# EAGLE design glove (EAGLE 7.7.0)

## Sheet 1 of 5
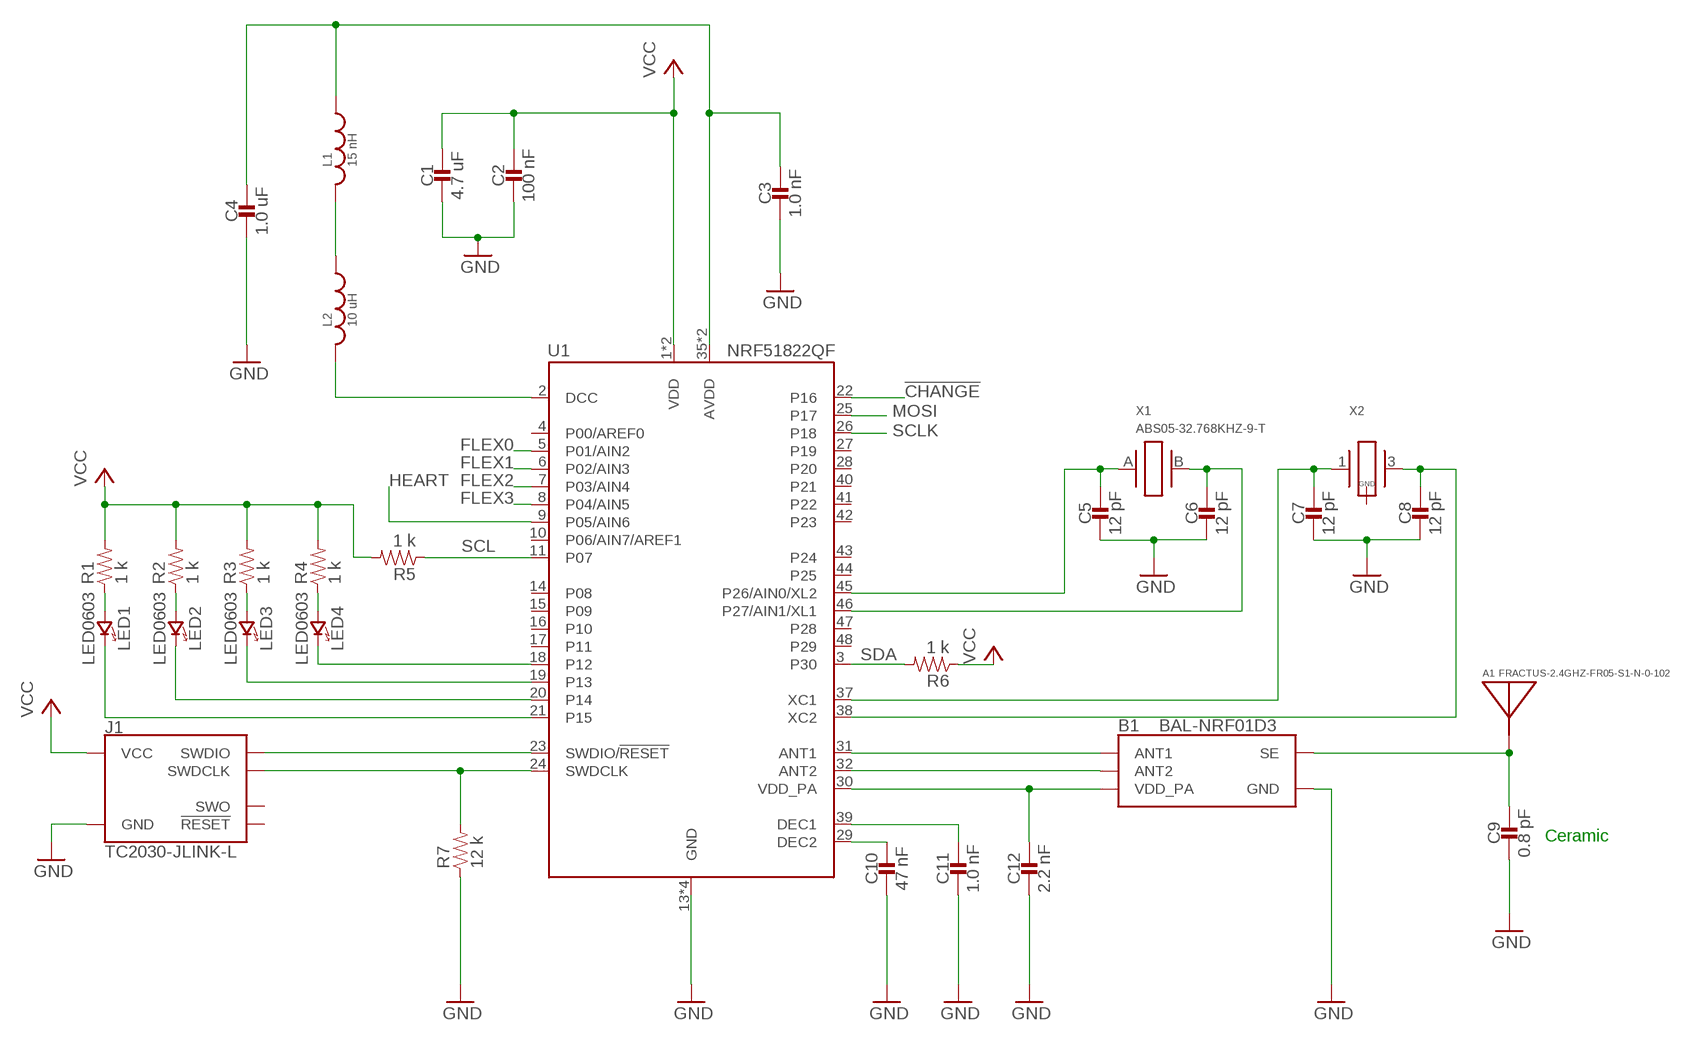
[diagram p0: schematic, sheet 1]

### Parts
A1  FRACTUS-2.4GHZ-FR05-S1-N-0-102  [FRACTUS-ANTENNA-FR05-S1-N-0-102]
B1  BAL-NRF01D3  [BAL-NRF01D3]
C1  4.7 uF  CAPACITOR0603_CAP  [0603_CAP]
C2  100 nF  CAPACITOR0402_CAP  [0402_CAP]
C3  1.0 nF  CAPACITOR0402_CAP  [0402_CAP]
C4  1.0 uF  CAPACITOR0603_CAP  [0603_CAP]
C5  12 pF  CAPACITOR0402_CAP  [0402_CAP]
C6  12 pF  CAPACITOR0402_CAP  [0402_CAP]
C7  12 pF  CAPACITOR0402_CAP  [0402_CAP]
C8  12 pF  CAPACITOR0402_CAP  [0402_CAP]
C9  0.8 pF  CAPACITOR0402_CAP  [0402_CAP]
C10  47 nF  CAPACITOR0402_CAP  [0402_CAP]
C11  1.0 nF  CAPACITOR0402_CAP  [0402_CAP]
C12  2.2 nF  CAPACITOR0402_CAP  [0402_CAP]
J1  TC2030-JLINK-L  [TC2030-IDC]
L1  15 nH  INDUCTOR0402  [0402_CAP]
L2  10 uH  INDUCTOR0603  [0603_CAP]
LED1  LED0603  [LED-0603]
LED2  LED0603  [LED-0603]
LED3  LED0603  [LED-0603]
LED4  LED0603  [LED-0603]
R1  1 k  RESISTOR0603_RES  [0603-RES]
R2  1 k  RESISTOR0603_RES  [0603-RES]
R3  1 k  RESISTOR0603_RES  [0603-RES]
R4  1 k  RESISTOR0603_RES  [0603-RES]
R5  1 k  RESISTOR0603_RES  [0603-RES]
R6  1 k  RESISTOR0603_RES  [0603-RES]
R7  12 k  RESISTOR0603_RES  [0603-RES]
U1  NRF51822QF  [QFN-48-6MM]
X1  ABS05-32.768KHZ-9-T  [ABS05]
X2  TXC-8Y  [TXC-8Y]

### Nets
!CHANGE: U1.22(P16) ; also sheet 3
FLEX0: U1.5(P01/AIN2) ; also sheet 5
FLEX1: U1.6(P02/AIN3) ; also sheet 5
FLEX2: U1.7(P03/AIN4) ; also sheet 5
FLEX3: U1.8(P04/AIN5) ; also sheet 5
GND: B1.GND C1.2 C2.2 C3.2 C4.2 C5.2 C6.2 C7.2 C8.2 C9.2 C10.2 C11.2 C12.2 J1.5(GND) R7.1 U1.13(GND) U1.33(GND) U1.34(GND) U1.GND ; also sheet 2,3,4,5
HEART: U1.9(P05/AIN6) ; also sheet 5
MOSI: U1.25(P17) ; also sheet 5
N$6: LED2.C(CATHODE) U1.20(P14)
N$8: LED2.A(ANODE) R2.1
N$10: LED1.C(CATHODE) U1.21(P15)
N$11: LED1.A(ANODE) R1.1
N$12: LED4.C(CATHODE) U1.18(P12)
N$13: LED4.A(ANODE) R4.1
N$14: L2.2 U1.2(DCC)
N$15: L1.2 L2.1
N$16: C3.1 C4.1 L1.1 U1.35(AVDD) U1.36(AVDD)
N$19: J1.2(SWDIO) U1.23(SWDIO/!RESET)
N$20: C8.1 U1.38(XC2) X2.3
N$21: B1.ANT1 U1.31(ANT1)
N$22: B1.ANT2 U1.32(ANT2)
N$23: B1.VCC(VDD_PA) C12.1 U1.30(VDD_PA)
N$24: A1.1(ANTENNA) B1.SE C9.1
N$25: C10.1 U1.29(DEC2)
N$26: C11.1 U1.39(DEC1)
N$27: C5.1 U1.45(P26/AIN0/XL2) X1.A
N$28: C6.1 U1.46(P27/AIN1/XL1) X1.B
N$29: C7.1 U1.37(XC1) X2.1
N$30: J1.4(SWDCLK) R7.2 U1.24(SWDCLK)
N$42: LED3.A(ANODE) R3.1
N$43: LED3.C(CATHODE) U1.19(P13)
SCL: R5.1 U1.11(P07) ; also sheet 2,3
SCLK: U1.26(P18) ; also sheet 5
SDA: R6.2 U1.3(P30) ; also sheet 2,3
VCC: C1.1 C2.1 J1.1(VCC) R1.2 R2.2 R3.2 R4.2 R5.2 R6.1 U1.1(VDD) U1.12(VDD) ; also sheet 2,3,4,5
Unconnected: J1.3(!RESET) J1.6(SWO) U1.4(P00/AREF0) U1.10(P06/AIN7/AREF1) U1.14(P08) U1.15(P09) U1.16(P10) U1.17(P11) U1.27(P19) U1.28(P20) U1.40(P21) U1.41(P22) U1.42(P23) U1.43(P24) U1.44(P25) U1.47(P28) U1.48(P29) X2.2(GND) X2.4(GND)

### Notes on the sheet
- Ceramic

## Sheet 2 of 5
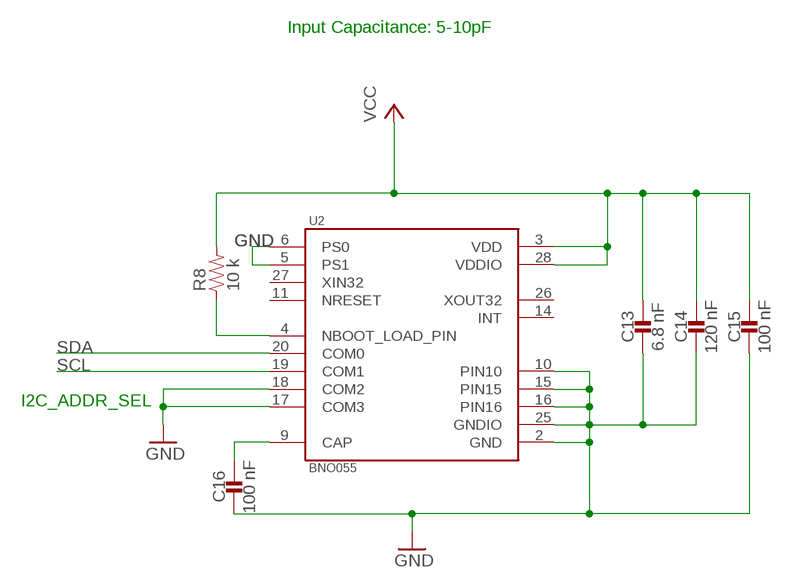
[diagram p1: schematic, sheet 2]

### Parts
C13  6.8 nF  CAPACITOR0603_CAP  [0603_CAP]
C14  120 nF  CAPACITOR0603_CAP  [0603_CAP]
C15  100 nF  CAPACITOR0603_CAP  [0603_CAP]
C16  100 nF  CAPACITOR0603_CAP  [0603_CAP]
R8  10 k  RESISTOR0603_RES  [0603-RES]
U2  BNO055  [LGA28R50P4X10_380X520X100]

### Nets
GND: C13.2 C14.2 C15.2 C16.2 U2.2(GND) U2.5(PS1) U2.6(PS0) U2.10(PIN10) U2.15(PIN15) U2.16(PIN16) U2.17(COM3) U2.18(COM2) U2.25(GNDIO) ; also sheet 1,3,4,5
N$9: C16.1 U2.9(CAP)
N$18: R8.1 U2.4(NBOOT_LOAD_PIN)
SCL: U2.19(COM1) ; also sheet 1,3
SDA: U2.20(COM0) ; also sheet 1,3
VCC: C13.1 C14.1 C15.1 R8.2 U2.3(VDD) U2.28(VDDIO) ; also sheet 1,3,4,5
Unconnected: U2.11(NRESET) U2.14(INT) U2.26(XOUT32) U2.27(XIN32)

### Notes on the sheet
- Input Capacitance: 5-10pF
- I2C_ADDR_SEL

## Sheet 3 of 5
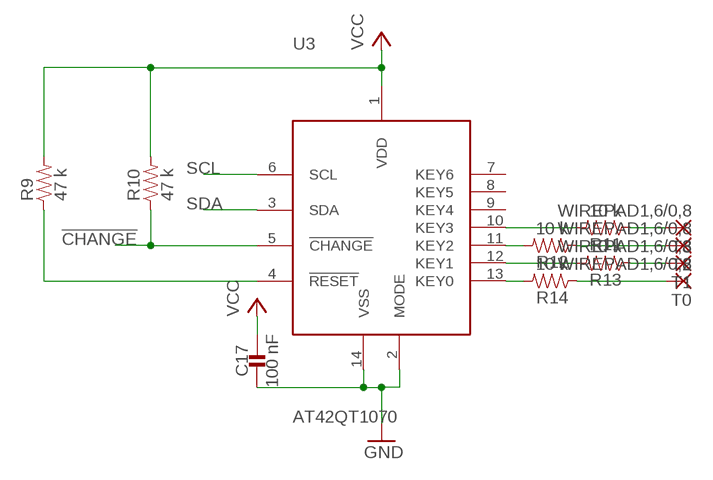
[diagram p2: schematic, sheet 3]

### Parts
C17  100 nF  CAPACITOR0603_CAP  [0603_CAP]
R9  47 k  RESISTOR0603_RES  [0603-RES]
R10  47 k  RESISTOR0603_RES  [0603-RES]
R11  10 k  RESISTOR0603_RES  [0603-RES]
R12  10 k  RESISTOR0603_RES  [0603-RES]
R13  10 k  RESISTOR0603_RES  [0603-RES]
R14  10 k  RESISTOR0603_RES  [0603-RES]
T0  WIREPAD1,6/0,8  [1,6/0,8]
T1  WIREPAD1,6/0,8  [1,6/0,8]
T2  WIREPAD1,6/0,8  [1,6/0,8]
T3  WIREPAD1,6/0,8  [1,6/0,8]
U3  AT42QT1070  [QT1070]

### Nets
!CHANGE: R10.1 U3.5(!CHANGE) ; also sheet 1
GND: C17.2 U3.2(MODE) U3.14(VSS) ; also sheet 1,2,4,5
N$31: R11.2 U3.10(KEY3)
N$32: R11.1 T3.1(P)
N$33: R12.2 U3.11(KEY2)
N$34: R12.1 T2.1(P)
N$35: R13.2 U3.12(KEY1)
N$36: R13.1 T1.1(P)
N$37: R14.2 U3.13(KEY0)
N$39: R14.1 T0.1(P)
N$40: R9.1 U3.4(!RESET)
SCL: U3.6(SCL) ; also sheet 1,2
SDA: U3.3(SDA) ; also sheet 1,2
VCC: C17.1 R9.2 R10.2 U3.1(VDD) ; also sheet 1,2,4,5
Unconnected: U3.7(KEY6) U3.8(KEY5) U3.9(KEY4)

## Sheet 4 of 5
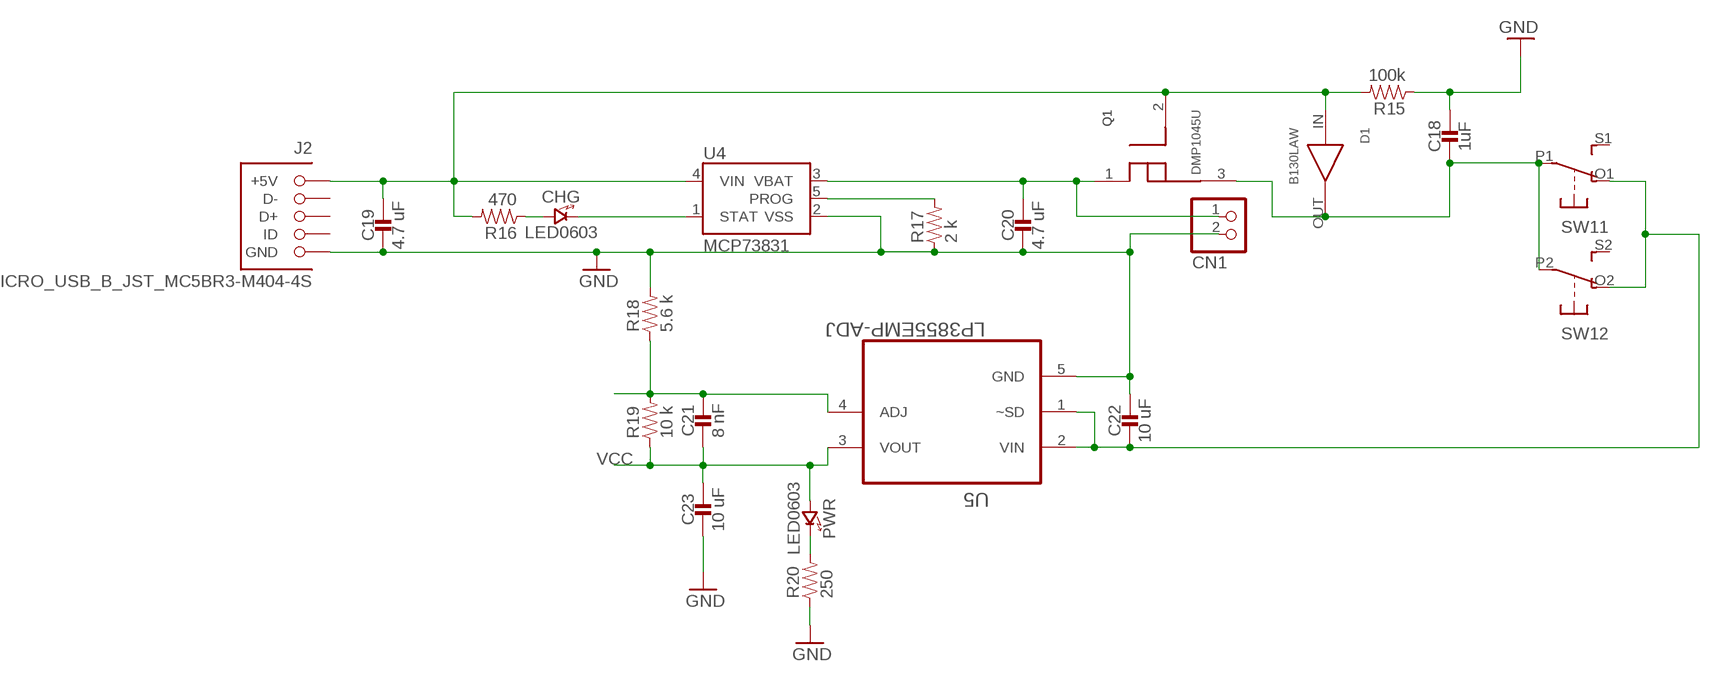
[diagram p3: schematic, sheet 4]

### Parts
C18  1uF  CAPACITOR0603_CAP  [0603_CAP]
C19  4.7 uF  CAPACITOR0603_CAP  [0603_CAP]
C20  4.7 uF  CAPACITOR0603_CAP  [0603_CAP]
C21  8 nF  CAPACITOR0603_CAP  [0603_CAP]
C22  10 uF  CAPACITOR0603_CAP  [0603_CAP]
C23  10 uF  CAPACITOR0603_CAP  [0603_CAP]
CHG  LED0603  [LED-0603]
CN1  JST_2PIN-SMT-RA  [JST-PH-2-SMT-RA]
D1  B130LAW  [2PIN]
J2  MICRO_USB_B_JST_MC5BR3-M404-4S  [USB_MICRO_B-JST-MC5BR3-M404-4S-TB]
PWR  LED0603  [LED-0603]
Q1  DMP1045U  [3PIN]
R15  100k  RESISTOR0603_RES  [0603-RES]
R16  470  RESISTOR0603_RES  [0603-RES]
R17  2 k  RESISTOR0603_RES  [0603-RES]
R18  5.6 k  RESISTOR0603_RES  [0603-RES]
R19  10 k  RESISTOR0603_RES  [0603-RES]
R20  250  RESISTOR0603_RES  [0603-RES]
SW1  DPDT-EG1390  [EG1390]
U4  MCP73831  [SOT23-5]
U5  LP3855EMP-ADJ  [SOT150P696X180-5N]

### Nets
GND: C18.1 C19.2 C20.2 C22.1 C23.2 CN1.2 J2.5(GND) R15.1 R17.1 R18.2 R20.1 U4.2(VSS) U5.5(GND) ; also sheet 1,2,3,5
N$1: C18.2 D1.OUT Q1.3(SOURCE) SW1.P1(1:P) SW1.P2(2:P)
N$2: CHG.A(ANODE) R16.1
N$3: CHG.C(CATHODE) U4.1(STAT)
N$4: R17.2 U4.5(PROG)
N$7: C21.1 R18.1 R19.2 U5.4(ADJ)
N$17: PWR.C(CATHODE) R20.2
N$38: C19.1 D1.IN J2.1(+5V) Q1.2(GATE) R15.2 R16.2 U4.4(VIN)
N$41: C20.1 CN1.1 Q1.1(DRAIN) U4.3(VBAT)
N$54: C22.2 SW1.O1(1:O) SW1.O2(2:O) U5.1(~SD) U5.2(VIN)
VCC: C21.2 C23.1 PWR.A(ANODE) R19.1 U5.3(VOUT) ; also sheet 1,2,3,5
Unconnected: J2.2(D-) J2.3(D+) J2.4(ID) SW1.S1(1:S) SW1.S2(2:S)

## Sheet 5 of 5
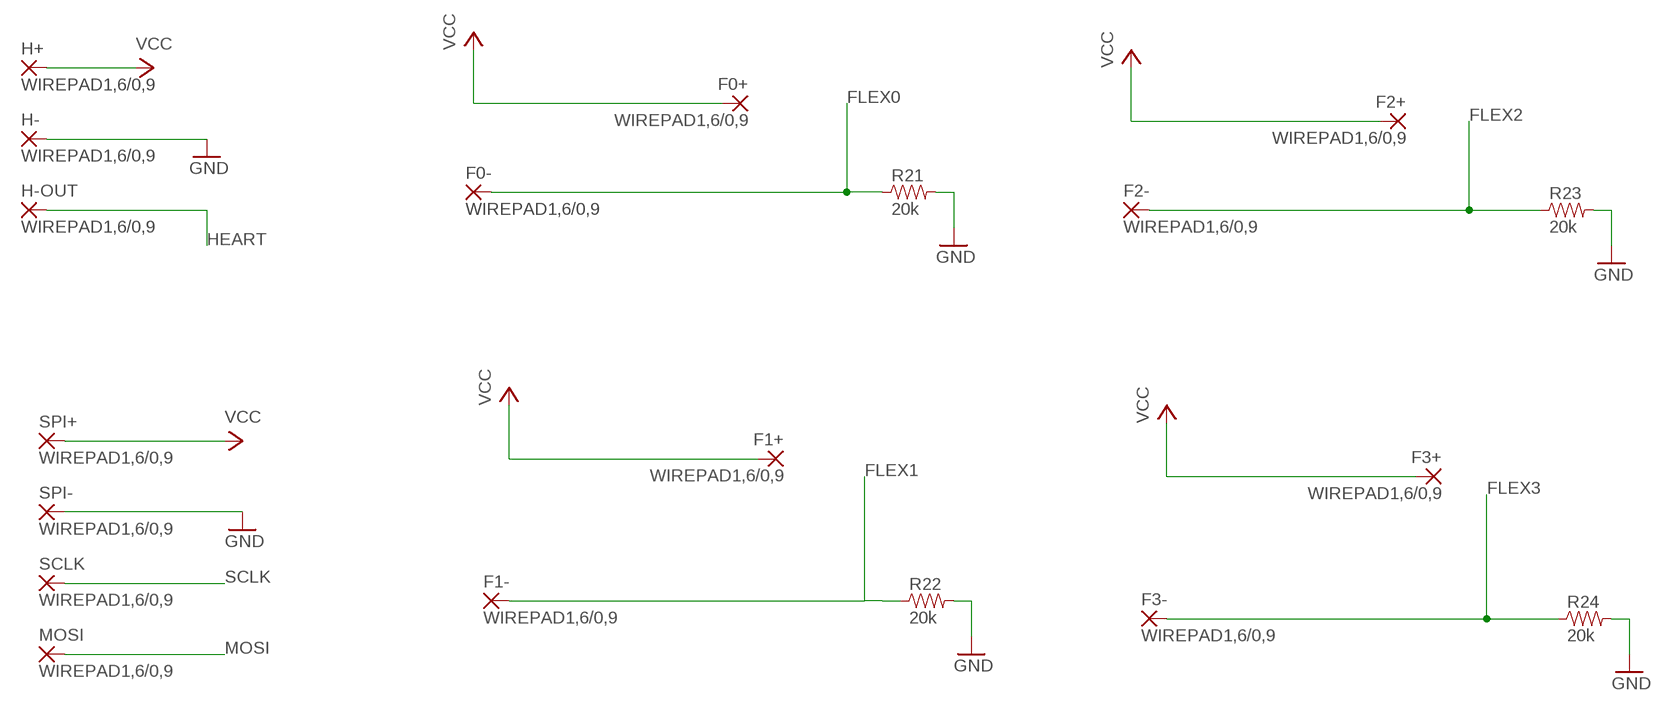
[diagram p4: schematic, sheet 5]

### Parts
F0+  WIREPAD1,6/0,9  [1,6/0,9]
F0-  WIREPAD1,6/0,9  [1,6/0,9]
F1+  WIREPAD1,6/0,9  [1,6/0,9]
F1-  WIREPAD1,6/0,9  [1,6/0,9]
F2+  WIREPAD1,6/0,9  [1,6/0,9]
F2-  WIREPAD1,6/0,9  [1,6/0,9]
F3+  WIREPAD1,6/0,9  [1,6/0,9]
F3-  WIREPAD1,6/0,9  [1,6/0,9]
H+  WIREPAD1,6/0,9  [1,6/0,9]
H-  WIREPAD1,6/0,9  [1,6/0,9]
H-OUT  WIREPAD1,6/0,9  [1,6/0,9]
MOSI  WIREPAD1,6/0,9  [1,6/0,9]
R21  20k  RESISTOR0603_RES  [0603-RES]
R22  20k  RESISTOR0603_RES  [0603-RES]
R23  20k  RESISTOR0603_RES  [0603-RES]
R24  20k  RESISTOR0603_RES  [0603-RES]
SCLK  WIREPAD1,6/0,9  [1,6/0,9]
SPI+  WIREPAD1,6/0,9  [1,6/0,9]
SPI-  WIREPAD1,6/0,9  [1,6/0,9]

### Nets
FLEX0: F0-.1(P) R21.1 ; also sheet 1
FLEX1: F1-.1(P) R22.1 ; also sheet 1
FLEX2: F2-.1(P) R23.1 ; also sheet 1
FLEX3: F3-.1(P) R24.1 ; also sheet 1
GND: H-.1(P) R21.2 R22.2 R23.2 R24.2 SPI-.1(P) ; also sheet 1,2,3,4
HEART: H-OUT.1(P) ; also sheet 1
MOSI: MOSI.1(P) ; also sheet 1
SCLK: SCLK.1(P) ; also sheet 1
VCC: F0+.1(P) F1+.1(P) F2+.1(P) F3+.1(P) H+.1(P) SPI+.1(P) ; also sheet 1,2,3,4

## Library data of the parts
A1 = chips:FRACTUS-2.4GHZ-FR05-S1-N-0-102: Fractus Compact Reach XtendTM chip antenna is engineered specifically for Bluetooth, WLAN 802.11 b/g/n and other wireless devices operating at the ISM 2.4 GHz band. Compact Reach Xtend combines small form factor size and high performance to improve the functionality of your wireless devices.; RICHARDSON_RFPD: FR05-S1-N-0102B
B1 = chips:BAL-NRF01D3: 50 ohm nominal input / conjugate match balun to nRF51422-QFAA, nRF24LE1, nRF51822-QFAA/AB, with integrated harmonic filter; DIGIKEY: 497-13637-1-ND; MOUSER: 511-BAL-NRF01D3
C1-C23 = passives:CAPACITOR: 0402 Capacitor
CHG LED1-LED4 PWR = leds:LED: LED
CN1 = adafruit:JST_2PIN: JST 2-Pin Connectors of various flavors SMT-RA (S2B-PH-SM4) 4UConnector #17311 SMT (B2B-PH-SM4) THM-RA (S2B-PH) THM (B2B-PH)
D1 = load_balance:B130LAW
F0+ F0- F1+ F1- F2+ F2- F3+ F3- H+ H- H-OUT MOSI SCLK SPI+ SPI- T0 T1-T3 = wirepad:WIREPAD: Wire PAD connect wire on PCB
J1 = connector:TC2030-JLINK
J2 = connector:MICRO_USB_B_JST_MC5BR3-M404-4S: Micro USB B mid mount; DIGIKEY: 455-2567-2-ND; MOUSER: 53X3655
L1 L2 = passives:INDUCTOR: A very specific inductor
Q1 = load_balance:DMP1045U
R1-R24 = passives:RESISTOR: Resistor Basic schematic elements and footprints for 0603, 1206, and PTH resistors.
SW1 = adafruit:DPDT
U1 = chips:NRF51822: Multiprotocol Bluetooth� 4.0 low energy/2.4 GHz RF SoC; DIGIKEY: 1490-1032-1-ND; MOUSER: 949-NRF51822-QFAB-R7
U2 = BNO055:BNO055: BNO055 9-axis Absolute Orientation Sensor ( SiP ) w/Sensors and Sensor Fusion; AVAILABILITY: Good; DESCRIPTION: BNO055 9-axis Absolute Orientation Sensor ( SiP ) w/Sensors and Sensor Fusion; MF: Bosch; MP: BNO055; PACKAGE: LGA-28 Bosch; PRICE: 9.48 USD
U3 = QT1070:AT42QT1070
U4 = SparkFun-PowerIC:MCP73831: Miniature single cell, fully integrated Li-Ion, Li-polymer charge management controller http://ww1.microchip.com/downloads/en/DeviceDoc/21984a.pdf
U5 = LP3855EMP-ADJ:LP3855EMP-ADJ: Linear Regulators; AVAILABILITY: Good; DESCRIPTION: 1.5A Fast Response Ultra Low Dropout Linear Regulators 5-SOT-223 -40 to 125; MF: Texas Instruments; MP: LP3855EMP-ADJ; PACKAGE: SOT-223 Texas Instruments; PRICE: 3.03 USD
X1 = crystals:ABS05-32.768KHZ: 32.768kHz Crystal; DIGIKEY: 535-11897-1-ND
X2 = crystals:TXC-8Y: 2mmx1.6mm SMD Crystal

## Board
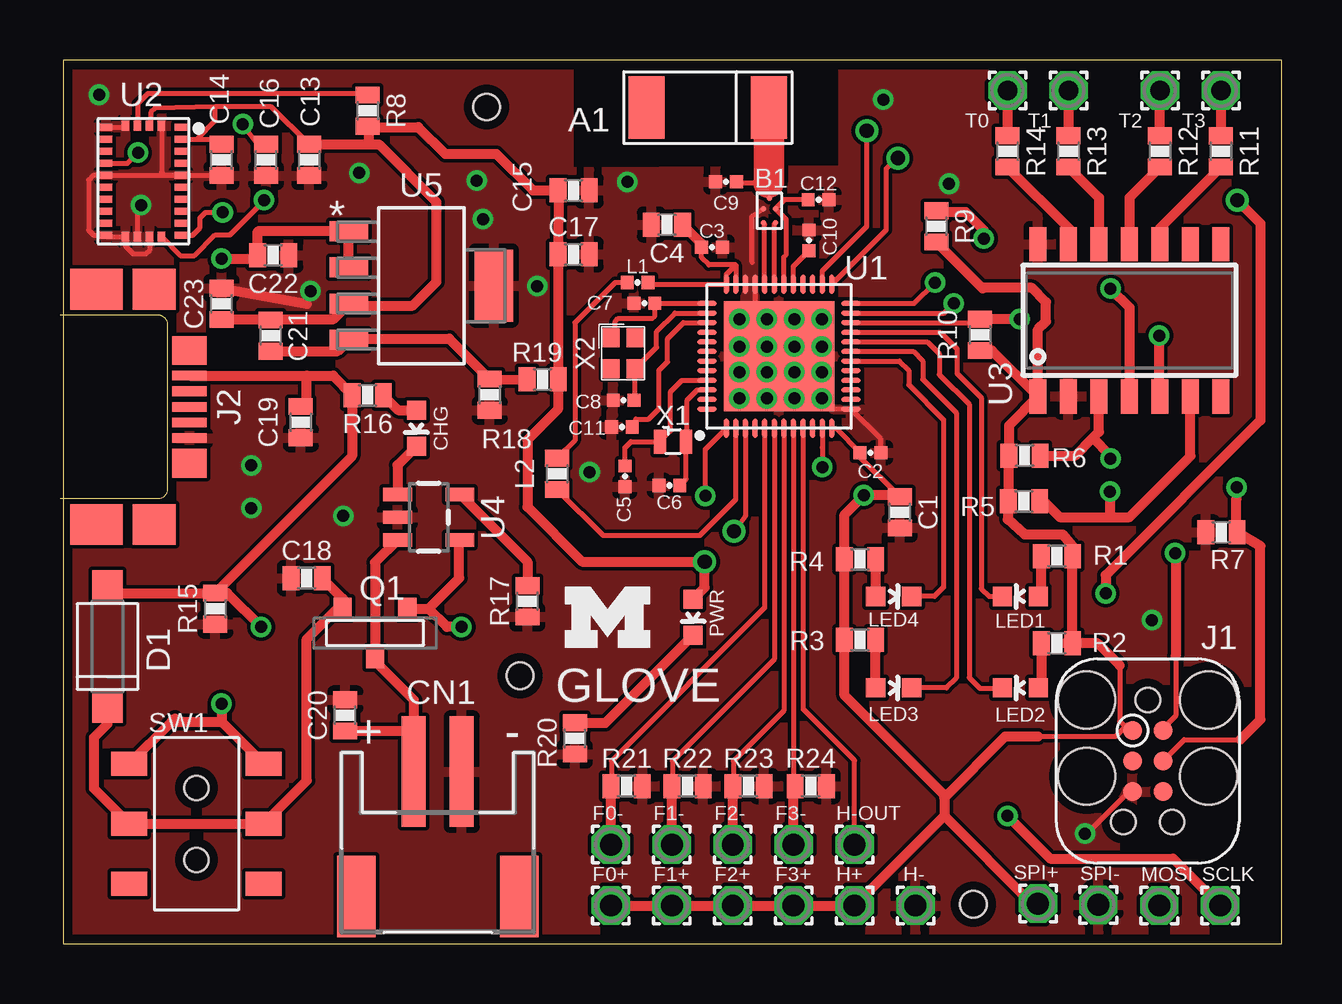
[diagram p5: board, top side]
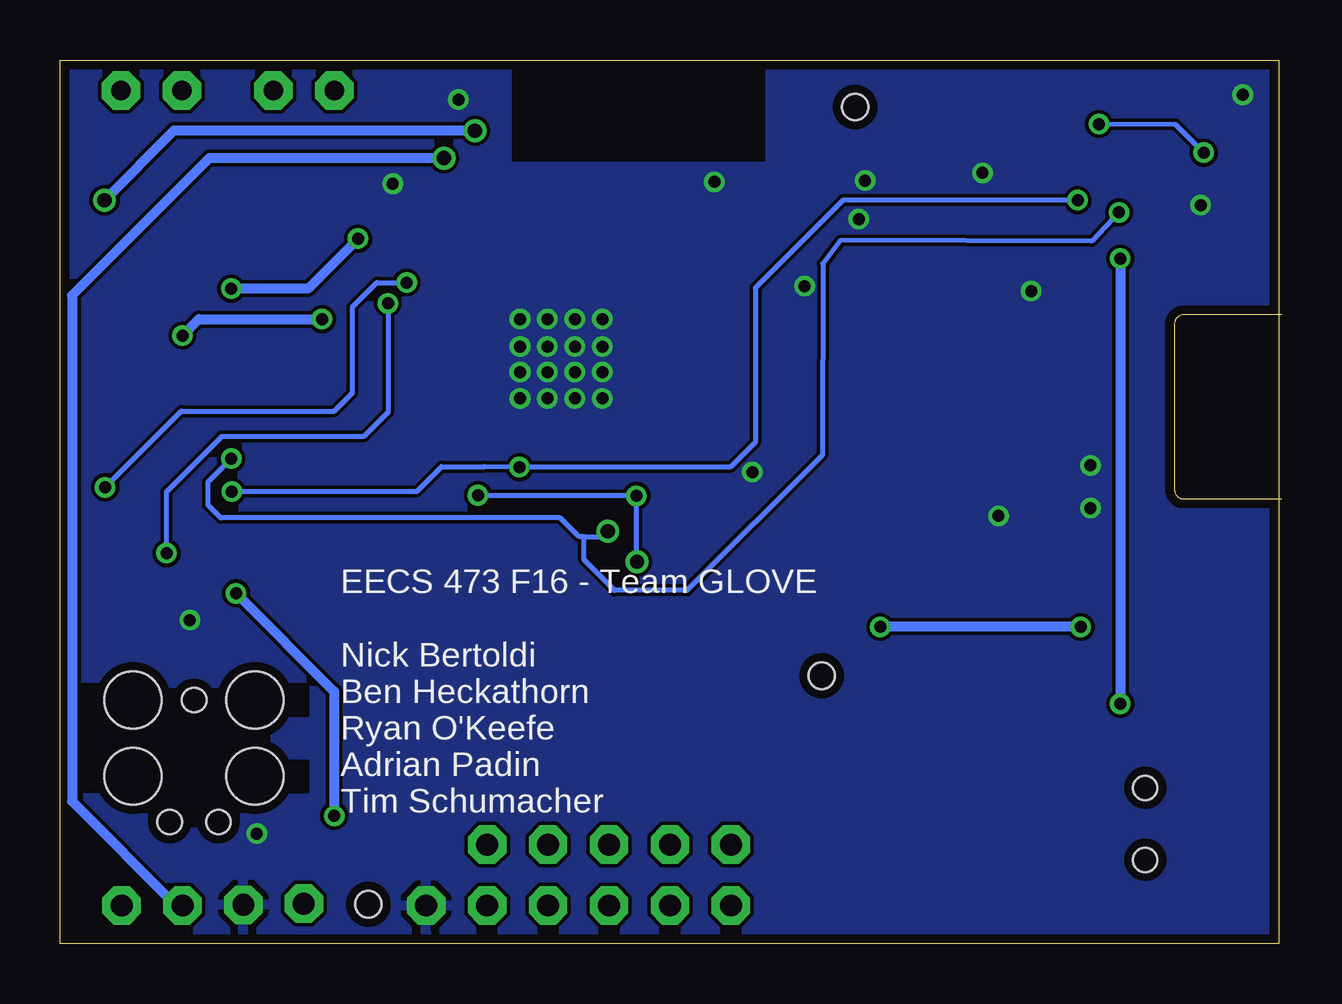
[diagram p6: board, bottom side, seen from below]

Size 50.8 x 36.83 mm. Coordinates in mm from the lower left corner, seen from the top.
Outline: 0,0 50.8,0 50.8,36.83 0,36.83 0,0
Copper layers (1*16): Top 0.0356mm / dielectric 1.5011mm / Bottom 0.0356mm
Design rules "oshpark-2layer *": minimum track width 6mil, minimum drill 13mil, track to track 6mil, track to pad 6mil, pad to pad 6mil, via to via 6mil, smd to smd 6mil, copper to edge 15mil, drill to drill 6mil, minimum pad ring 7mil, minimum via ring 7mil, stop-mask expansion 2.5mil, vias tented up to drill 0mil, thermal gap 10mil
Holes 1.1 mm at 17.65,34.87 19.05,11.18 37.95,1.65

### Footprints (pad centres in the part's own frame; a part is rotated, then mirrored left to right if it is on the bottom)
FRACTUS-ANTENNA-FR05-S1-N-0-102 = smd 1.5 x 2.6: 1 -2.55,0; 2 2.55,0
BAL-NRF01D3 = smd 0.22 x 0.22: ANT1 -0.517,-0.25; ANT2 -0.517,0.25; GND 0.083,0.25; SE 0.516,0; VCC 0.083,-0.25
0603_CAP = smd 0.7 x 1: 1 -0.65,0; 2 0.65,0
0402_CAP = smd 0.536 x 0.546: 1 -0.433,0; 2 0.433,0
LED-0603 = smd 0.8 x 0.8: A 0,-0.75; C 0,0.75
JST-PH-2-SMT-RA = smd 1 x 4.6: 1 1,-3.7; 2 -1,-3.7 | smd 1.6 x 3.4: NC1 -3.4,1.5; NC2 3.4,1.5
2PIN = smd 1.27 x 1.27: IN -2.54,0; OUT 2.54,0
1,6/0,9 = drill 0.914 pad 1.6 octagon: 1 0,0
TC2030-IDC = smd 0.787 x 0.787: 1 -1.27,-0.635; 2 -1.27,0.635; 3 0,-0.635; 4 0,0.635; 5 1.27,-0.635; 6 1.27,0.635 | hole 2.375: -2.54,2.54; 0.635,2.54; 0.635,-2.54; -2.54,-2.54 | hole 1.016: -2.54,0; 2.54,1.016; 2.54,-1.016
USB_MICRO_B-JST-MC5BR3-M404-4S-TB = smd 0.4 x 1.45: 1 -1.3,3.875; 2 -0.65,3.875; 3 0,3.875; 4 0.65,3.875; 5 1.3,3.875 | smd 1.7 x 2.2: P$1 -4.9,0; P$2 4.9,0 | smd 1.7 x 1.8: P$3 -4.9,2.4; P$4 4.9,2.4 | smd 1.2 x 1.45: P$5 -2.35,3.875; P$6 2.35,3.875
3PIN = smd 0.762 x 0.889: 1 0,1.016; 2 -1.346,-1.016; 3 1.346,-1.016
0603-RES = smd 0.7 x 1: 1 -0.65,0; 2 0.65,0
EG1390 = smd 1 x 1.5: O1 -2.5,2.8; O2 -2.5,-2.8; P1 0,2.8; P2 0,-2.8; S1 2.5,2.8; S2 2.5,-2.8 | hole 1: 1.5,0; -1.5,0
1,6/0,8 = drill 0.813 pad 1.6 octagon: 1 0,0
QFN-48-6MM = smd 0.8 x 0.203: 1 -3,2.2; 2 -3,1.8; 3 -3,1.4; 4 -3,1; 5 -3,0.6; 6 -3,0.2; 7 -3,-0.2; 8 -3,-0.6; 9 -3,-1; 10 -3,-1.4; 11 -3,-1.8; 12 -3,-2.2; 25 3,-2.2; 26 3,-1.8; 27 3,-1.4; 28 3,-1; 29 3,-0.6; 30 3,-0.2; 31 3,0.2; 32 3,0.6; 33 3,1; 34 3,1.4; 35 3,1.8; 36 3,2.2 | smd 0.203 x 0.8: 13 -2.2,-3; 14 -1.8,-3; 15 -1.4,-3; 16 -1,-3; 17 -0.6,-3; 18 -0.2,-3; 19 0.2,-3; 20 0.6,-3; 21 1,-3; 22 1.4,-3; 23 1.8,-3; 24 2.2,-3; 37 2.2,3; 38 1.8,3; 39 1.4,3; 40 1,3; 41 0.6,3; 42 0.2,3; 43 -0.2,3; 44 -0.6,3; 45 -1,3; 46 -1.4,3; 47 -1.8,3; 48 -2.2,3 | smd 4.6 x 4.6: GND 0,0
LGA28R50P4X10_380X520X100 = smd 0.3 x 0.525: 1 -2.25,1.562; 6 -2.25,-1.562; 7 -1.75,-1.562; 8 -1.25,-1.562; 9 -0.75,-1.562; 10 -0.25,-1.562; 11 0.25,-1.562; 12 0.75,-1.562; 13 1.25,-1.562; 14 1.75,-1.562; 15 2.25,-1.562; 20 2.25,1.562; 21 1.75,1.562; 22 1.25,1.562; 23 0.75,1.562; 24 0.25,1.562; 25 -0.25,1.562; 26 -0.75,1.562; 27 -1.25,1.562; 28 -1.75,1.562 | smd 0.425 x 0.3: 2 -2.312,0.75; 3 -2.312,0.25; 4 -2.312,-0.25; 5 -2.312,-0.75; 16 2.312,-0.75; 17 2.312,-0.25; 18 2.312,0.25; 19 2.312,0.75
QT1070 = smd 1.422 x 0.711: 1 -3.175,3.81; 2 -3.175,2.54; 3 -3.175,1.27; 4 -3.175,0; 5 -3.175,-1.27; 6 -3.175,-2.54; 7 -3.175,-3.81; 8 3.175,-3.81; 9 3.175,-2.54; 10 3.175,-1.27; 11 3.175,0; 12 3.175,1.27; 13 3.175,2.54; 14 3.175,3.81
SOT23-5 = smd 0.55 x 1.2: 1 -0.95,-1.3; 2 0,-1.3; 3 0.95,-1.3; 4 0.95,1.3; 5 -0.95,1.3
SOT150P696X180-5N = smd 1.6 x 0.838: 1 -3.023,2.261; 2 -3.023,0.762; 3 -3.023,-0.762; 4 -3.023,-2.261 | smd 1.6 x 2.997: 5 3.023,0
ABS05 = smd 0.5 x 1: A -0.55,0; B 0.55,0
TXC-8Y = smd 0.8 x 0.7: 1 -0.65,-0.5; 2 0.65,-0.5; 3 0.65,0.5; 4 -0.65,0.5

### Placement (x,y rotation side)
A1  26.87,34.85 180 top
B1  29.44,30.56 90 top
C1  34.87,17.98 270 top
C2  33.66,20.47 0 top
C3  27.05,29.03 0 top
C4  25.17,29.97 180 top
C5  23.42,19.48 270 top
C6  25.27,19.1 180 top
C7  24.23,26.7 180 top
C8  23.37,22.66 180 top
C9  27.64,31.75 180 top
C10  31.09,29.31 90 top
C11  23.29,21.54 180 top
C12  31.5,31.01 0 top
C13  10.26,32.66 270 top
C14  6.6,32.66 270 top
C15  21.29,31.39 0 top
C16  8.46,32.66 270 top
C17  21.29,28.73 0 top
C18  10.16,15.24 0 top
C19  9.91,21.74 270 top
C20  11.76,9.53 90 top
C21  8.66,25.35 90 top
C22  8.76,28.7 180 top
C23  6.6,26.67 90 top
CHG  14.73,21.49 180 top
CN1  15.62,3.48 180 top
D1  1.85,12.4 270 top
F0+  22.83,1.6 0 top
F0-  22.83,4.14 0 top
F1+  25.37,1.6 0 top
F1-  25.37,4.14 0 top
F2+  27.91,1.6 0 top
F2-  27.91,4.14 0 top
F3+  30.45,1.6 0 top
F3-  30.45,4.14 0 top
H+  32.99,1.6 0 top
H-  35.53,1.6 0 top
H-OUT  32.99,4.14 0 top
J1  45.21,7.62 270 top
J2  1.4,22.38 270 top
L1  23.95,27.56 180 top
L2  20.6,19.58 270 top
LED1  39.9,14.48 90 top
LED2  39.9,10.67 90 top
LED3  34.62,10.67 270 top
LED4  34.62,14.48 270 top
MOSI  45.69,1.6 0 top
PWR  26.26,13.61 180 top
Q1  13,12.95 180 top
R1  41.43,16.15 0 top
R2  41.43,12.52 0 top
R3  33.22,12.67 180 top
R4  33.22,16.03 180 top
R5  40.06,18.44 180 top
R6  40.08,20.35 0 top
R7  48.29,17.14 0 top
R8  12.7,34.72 270 top
R9  36.4,29.9 270 top
R10  38.23,25.37 270 top
R11  48.26,33.02 270 top
R12  45.72,33.02 270 top
R13  41.91,33.02 270 top
R14  39.37,33.02 270 top
R15  6.35,13.97 90 top
R16  12.7,22.86 180 top
R17  19.35,14.27 90 top
R18  17.78,22.89 270 top
R19  19.99,23.52 180 top
R20  21.34,8.56 90 top
R21  23.5,6.58 0 top
R22  26.04,6.58 0 top
R23  28.57,6.58 0 top
R24  31.17,6.58 0 top
SCLK  48.23,1.6 0 top
SPI+  40.64,1.68 0 top
SPI-  43.15,1.63 0 top
SW1  5.56,5 270 top
T0  39.37,35.56 0 top
T1  41.91,35.56 0 top
T2  45.72,35.56 0 top
T3  48.26,35.56 0 top
U1  29.84,24.49 90 top
U2  3.35,31.78 270 top
U3  44.45,25.98 90 top
U4  15.24,17.78 270 top
U5  14.94,27.43 0 top
U$1  [UMICH_SOLID_100MIL]  20.93,12.34 0 top
X1  25.43,20.93 0 top
X2  23.34,24.61 270 top

### Tracks (layer width: path | path; a pad name or v marks a point on that pad's centre or on a via)
!CHANGE  (via drill 0.5)
  Top 0.203: U1.22 38.09,25.89 R10.1
  Top 0.406: U3.5 45.74,22.84 45.7,22.88 v45.7,25.35 | v39.88,26.03 38.24,26.03 R10.1
  Bottom 0.406: v45.7,25.35 45.01,26.03 v39.88,26.03
FLEX0
  Top 0.203: U1.5 29.25,14.01 22.86,7.62 22.86,6.57 R21.1 22.84,6.54
  Top 0.406: F0-.1 22.84,6.54
FLEX1
  Top 0.203: U1.6 29.64,11.87 25.4,7.62 25.4,6.59 R22.1
  Top 0.406: F1-.1 25.39,4.14 R22.1
FLEX2
  Top 0.203: U1.7 30.05,9.72 27.94,7.62 27.94,6.59 R23.1
  Top 0.406: F2-.1 27.93,4.14 R23.1
FLEX3
  Top 0.203: U1.8 30.45,6.65 R24.1
  Top 0.406: F3-.1 30.45,6.33 30.48,6.35 30.48,6.54 R24.1
GND  (via drill 0.5)
  Top 0.203: 28.72,28.4 28.72,30.32 B1.GND | U1.33 28.84,25.38 v29.34,24.89 | U1.GND 32.05,22.29 U1.13 34.09,21.04 C2.2 | U2.6 2.54,34.02 U2.5 | U2.17 3.1,30.61 3.23,30.73 | U2.2 4.1,32.17 4.25,32.02 U2.25 | U2.25 U2.10 1.27,32.02 1.07,31.83 1.07,29.74 1.28,29.52 U2.15 1.85,29.46 U2.16 2.6,29.07 2.92,28.75 3.45,28.75 3.63,28.93 3.63,29.43 | U2.25 6.59,32.02 C14.2 | 44.73,6.17 J1.5 44.42,6.35 42.67,4.6 v42.6,4.6
  Top 0.406: C23.2 10.16,26.67
  other vias: 3.25,30.78 1.5,35.38 12.34,32.13 10.31,27.2 17.25,31.8 23.52,31.75 11.68,17.83 7.85,18.16 21.95,19.66 34.19,35.18 45.39,13.49 28.19,26.03 29.34,26.03 30.48,26.03 31.62,26.03 28.19,24.89 30.48,24.89 31.62,24.89 28.19,23.83 29.34,23.83 30.48,23.83 31.62,23.83 28.19,22.73 29.34,22.73 30.48,22.73 31.62,22.73 36.93,31.67 17.5,30.2 19.76,27.41 7.85,19.94
  pour Top: -0.1,37.59 0,0 50.8,0 51.05,37.54 32.51,37.54 32.51,32.23 22.28,32.16 21.08,32.18 21.08,37.46
  pour Bottom: 0,0 51.51,0 51.51,37.34 32.18,37.34 32.18,32.41 21.18,32.41 21.18,37.57 0,37.62
HEART
  Top 0.203: U1.9 30.84,9.79 32.99,7.64 H-OUT.1
MOSI  (via drill 0.6)
  Top 0.203: U1.25 34.31,29.76 34.31,32.31 34.75,32.74 v34.8,32.74
  Bottom 0.406: v34.8,32.74 44.58,32.74 50.29,27.03 50.29,5.94 45.95,1.6 MOSI.1
N$1
  Top 0.406: D1.OUT 1.85,9.17 1.29,8.61 1.29,6.47 SW1.P2 SW1.P1 10.16,6.8 10.16,12.7 11.43,13.97 Q1.3 11.66,14.39 C18.2
N$2
  Top 0.406: R16.1 13.97,22.24 CHG.A
N$3
  Top 0.406: CHG.C 13.94,19.95 U4.1
N$4
  Top 0.406: U4.5 19.36,15.92 R17.2
N$6
  Top 0.203: U1.20 36.03,25.09 36.52,24.59 36.52,23.72 37.77,22.48 37.77,11.1 38.23,10.64 39.13,10.64 LED2.C
N$7
  Top 0.406: R19.2 17.8,23.51 R18.1 16.09,25.22 11.96,25.22 U5.4 11.44,24.7 C21.1
N$8
  Top 0.406: R2.1 40.78,10.79 LED2.A
N$9  (via drill 0.5)
  Top 0.203: U2.9 2.68,32.52 v3.12,32.97 | C16.1 8.15,33.25 v7.49,34.16
  Bottom 0.203: v3.12,32.97 4.29,34.14 v7.49,34.16
N$10
  Top 0.203: U1.21 36.57,25.49 37.26,24.79 37.26,23.77 38.28,22.76 38.28,14.81 38.61,14.48 LED1.C
N$11
  Top 0.406: LED1.A 40.78,14.6 R1.1
N$12
  Top 0.203: U1.18 34.87,24.29 35.26,23.9 35.26,23.29 36.7,21.84 36.7,14.86 36.32,14.48 LED4.C
N$13
  Top 0.406: R4.1 33.87,15.92 LED4.A
N$14
  Top 0.203: L2.2 22.52,17.02 26.54,17.02 28.05,18.52 U1.2
N$15
  Top 0.203: L1.2 23.01,27.56 21.34,25.88 21.34,20.97 L2.1
N$16
  Top 0.203: L1.1 24.39,27.49 U1.36 27.64,27.9 28.04,28.3 | 28.04,28.3 U1.35 | 28.04,28.3 26.92,28.3 26.62,28.6 C3.1
  Top 0.406: C3.1 26.62,29.17 C4.1
N$17
  Top 0.406: R20.2 22.61,9.21 PWR.C
N$18
  Top 0.203: R8.1 12.64,35.43 3.53,35.43 3.1,35.01 U2.4
N$19  (via drill 0.5)
  Top 0.203: U1.23 36.73,26.29 v37.13,26.69 | 46.38,11.99 46.38,9.5 45.85,8.97 J1.2
  Top 0.406: v46.35,16.28 46.38,16.26 46.38,11.99
  Bottom 0.203: v37.13,26.69 37.13,22.15 38.15,21.13 44.07,21.13 46.35,18.85 v46.35,16.28
N$20
  Top 0.203: 26.6,26.29 U1.38 25.5,26.29 24.74,25.53 24.74,24.86 X2.3 23.84,22.84 C8.1
N$21
  Top 0.203: U1.31 29.64,30 B1.ANT1
N$22
  Top 0.203: U1.32 29.25,29.98 B1.ANT2
N$23
  Top 0.203: U1.30 30.05,28.62 30.15,28.72 30.15,30.18 B1.VCC 30.06,31.01 C12.1
N$24
  Top 0.203: B1.SE 29.44,31.7 29.41,31.73 28.09,31.73 C9.1
  Top 1.27: A1.1 29.42,31.73 29.41,31.73
N$25
  Top 0.203: U1.29 30.45,28.23 C10.1
N$26
  Top 0.203: U1.39 25.86,25.89 25.2,25.22 25.2,24.26 24.84,23.9 24.84,22.3 24.41,21.87 23.88,21.87 C11.1
N$27
  Top 0.203: U1.45 25.8,23.49 25.32,23.01 25.32,21.38 X1.A 23.67,20.93 23.42,20.68 C5.1
N$28
  Top 0.203: X1.B 26.01,20.96 26.01,22.66 26.44,23.09 U1.46 | X1.B | C6.1 25.98,19.37 X1.B
N$29
  Top 0.203: U1.37 C7.1 24.66,26.16 24.56,26.06 23.14,26.06 23.01,25.93 23.01,25.43 X2.1
N$30  (via drill 0.5)
  Top 0.203: U1.24 35.47,26.69 v36.35,27.56 | J1.4 46.74,8.51 49.07,8.51
  Top 0.406: v48.92,19.02 48.92,18.54 48.9,18.52 48.9,17.11 R7.2 49.91,16.58 49.91,9.35 49.07,8.51
  Bottom 0.203: v48.92,19.02 45.74,22.2 39.37,22.2 38.61,22.96 38.61,26.54 37.59,27.56 v36.35,27.56
N$31
  Top 0.406: R11.2 45.72,29.83 U3.10
N$32
  Top 0.406: T3.1 R11.1
N$33
  Top 0.406: R12.2 44.45,31.1 U3.11
N$34
  Top 0.406: R12.1 T2.1
N$35
  Top 0.406: R13.2 43.18,31.1 U3.12
N$36
  Top 0.406: T1.1 R13.1
N$37
  Top 0.406: U3.13 41.96,29.21 41.96,29.78 R14.2
N$38  (via drill 0.5)
  Top 0.406: J2.1 10.16,23.68 | 10.16,23.68 11.26,23.68 R16.2 12.05,20.32 R15.2 | C19.1 10.16,22.65 10.16,23.68 | D1.IN 2.17,14.62 R15.2 | Q1.2 15.24,13.97 | 15.24,13.97 16.51,15.24 16.51,16.8 U4.4 | v16.61,13.21 16,13.21 15.24,13.97 | R15.2 6.84,14.62 v8.26,13.21
  Bottom 0.406: v8.26,13.21 v16.61,13.21
N$39
  Top 0.406: T0.1 R14.1
N$40  (via drill 0.5)
  Top 0.406: R9.1 36.44,30.51 37.62,30.51 38.38,29.74 v38.38,29.39 | v43.66,27.3 44.45,26.52 U3.4
  Bottom 0.406: v38.38,29.39 40.46,27.3 v43.66,27.3
N$41
  Top 0.406: U4.3 13.01,15.89 Q1.1 12.93,11.86 14.62,10.17 14.62,8.89 | 14.62,8.89 CN1.1 | C20.1 11.78,8.89 14.62,8.89
N$42
  Top 0.406: LED3.A 33.87,12.19 R3.1
N$43
  Top 0.203: U1.19 35.44,24.69 35.84,24.28 35.84,23.52 37.24,22.12 37.24,11.07 36.83,10.67 LED3.C
N$54  (via drill 0.5)
  Top 0.406: U5.2 U5.1 8.11,29.69 C22.2 | 8.11,28.92 C22.2 | v6.6,10.01 6.6,9.26 | 6.6,9.26 SW1.O1 | v6.6,28.55 7.96,28.55 C22.2 | SW1.O2 4.52,9.26 | 4.52,9.26 6.6,9.26 | 4.66,9.4 4.52,9.26
  Bottom 0.406: v6.6,28.55 v6.6,10.01
SCL  (via drill 0.5)
  Top 0.203: U1.11 31.64,20.68 v31.65,19.86 | U2.19 4.89,28.68 5.49,28.68 6.35,29.54 6.96,29.54 8.38,30.96 v8.38,30.99
  Top 0.406: 43.64,17.78 41.54,17.78 40.68,18.64 R5.1 | 43.64,17.78 44.45,17.78 46.99,20.32 U3.6 | v43.64,18.85 43.64,17.78
  Bottom 0.203: v43.64,18.85 35.94,18.85 34.9,19.89 33.12,19.89 v31.65,19.86 22.86,19.86 21.82,20.9 21.82,27.33 18.16,30.99 v8.38,30.99
SCLK  (via drill 0.5, 0.6)
  Top 0.203: U1.26 31.65,28.04 33.5,29.9 v33.5,33.88
  Top 0.406: v48.95,30.99 49.91,30.02 49.91,21.82 43.46,15.37 v43.46,14.61 | SCLK.1 46.28,3.56 41.15,3.56 v39.37,5.33
  Bottom 0.406: v48.95,30.99 46.05,33.88 v33.5,33.88 | v43.46,14.61 39.37,10.52 v39.37,5.33
SDA  (via drill 0.5, 0.6)
  Top 0.203: U2.20 5.39,29.52 5.71,29.84 5.71,30.25 5.94,30.48 v6.66,30.48 | U1.3 28.45,17.83 v27.96,17.2
  Top 0.406: R6.2 42.19,20.34 42.93,21.08 | 42.93,21.08 43.18,21.34 U3.3 | v43.66,20.22 43.66,20.34 42.93,21.08
  Bottom 0.203: v43.66,20.22 44.63,19.25 44.63,18.29 44.09,17.76 29.95,17.76 29.16,16.97 28.96,16.97 | v6.66,30.48 7.8,29.29 18.26,29.31 19,28.35 19.02,20.37 24.66,14.73 27.69,14.73 28.96,16 28.96,16.97 | 28.96,16.97 28.19,16.97 v27.96,17.2
VCC  (via drill 0.5, 0.6)
  Top 0.203: U2.3 3.66,34.14 3.66,34.65 3.83,34.82 6.35,34.87 | 32.08,21.45 U1.12 32.21,21.49 C2.1 | 27.64,21.48 U1.1 26.77,20.61 v26.77,18.67 | C13.1 8.68,34.87 6.35,34.87 | U5.3 11.99,26.59 | R19.1 20.62,23.51 | 34.86,18.62 C1.1 34.81,18.69 33.22,20.29 C2.1 | 6.35,34.87 6.35,34.29 5.58,33.52 U2.28 6.39,33.52 C14.1 | C2.1 33.06,20.47 | C21.2 8.64,26.02 8.88,26.02 8.89,26.03 | 12.74,33.35 12.7,33.31 | 40.64,8.64 43.87,8.64 44.35,9.12 J1.1 44.42,8.89 44.04,9.27 44.04,11.61
  Top 0.406: R9.2 38.34,27.3 38.36,27.33 40.39,27.33 40.97,26.75 40.97,25.93 40.64,25.6 U3.1 | 22.63,1.6 F0+.1 F1+.1 F2+.1 F3+.1 H+.1 | R8.2 12.74,34.04 | 20.47,31.39 C15.1 | 11.99,26.59 14.58,26.59 15.57,27.58 15.57,30.91 13.17,33.31 12.7,33.31 C13.1 | C15.1 20.66,31.37 C17.1 20.64,27.82 R19.1 | 20.62,23.51 20.62,22.28 19.36,21.01 19.36,18.21 21.64,15.93 v26.75,15.93 26.75,14.85 PWR.A | R10.2 38.73,24.73 U3.1 | 34.81,18.69 v33.38,18.69 32.57,17.89 R4.2 R3.2 32.57,10.35 36.73,6.2 36.73,6.1 | 8.21,26.03 8.89,26.03 11.28,26.03 U5.3 | C23.1 8.64,26.02 | 12.74,34.04 12.74,33.35 | R5.2 39.38,17.69 40.08,17.07 41.66,17.07 42.08,16.57 R1.2 R2.2 | H+.1 33.05,1.6 | 12.74,34.04 14.81,34.04 15.93,32.92 18.06,32.92 19.58,31.39 C15.1 | U3.1 39.43,21.6 R6.1 39.41,20.32 R5.2 | R2.2 41.58,12.51 | H+.1 36.73,5.33 | 36.73,6.1 36.73,5.33 | 36.73,5.33 40.39,1.68 SPI+.1 | R2.2 43.13,12.52 44.04,11.61 | R5.2 39.37,18.41 | 40.64,8.64 39.27,8.64 36.73,6.1
  Bottom 0.203: v26.75,15.93 26.77,15.95 v26.77,18.67 26.8,18.69 v33.38,18.69

### Text on the board
tPlace: GLOVE
bPlace: EECS 473 F16 - Team GLOVE / / Nick Bertoldi / Ben Heckathorn / Ryan O'Keefe / Adrian Padin / Tim Schumacher